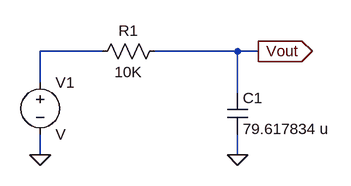
[diagram p0: schematic Draft2.asc]
Draft2.asc, the LTspice schematic file:
Version 4
SHEET 1 880 680
WIRE 112 80 16 80
WIRE 320 80 192 80
WIRE 352 80 320 80
WIRE 16 128 16 80
WIRE 320 144 320 80
WIRE 16 240 16 208
WIRE 320 240 320 208
FLAG 16 240 0
FLAG 320 240 0
FLAG 352 80 Vout
IOPIN 352 80 Out
SYMBOL voltage 16 112 R0
SYMATTR InstName V1
SYMBOL res 208 64 R90
WINDOW 0 0 56 VBottom 2
WINDOW 3 32 56 VTop 2
SYMATTR InstName R1
SYMATTR Value 10K
SYMBOL cap 304 144 R0
SYMATTR InstName C1
SYMATTR Value 79.617834 u

The netlist it stands for:
* Draft2.asc
V1 N001 0 V
R1 Vout N001 10K
C1 Vout 0 79.617834 u
.backanno
.end